# Altium schematic sheet Feeder_1U.SchDoc
size 594 x 420 mm; SheetNumber: 1; SheetTotal: 1; SPICEModelCacheOGAMDFTO: <root> / <DocumentId>OGAMDFTO</DocumentId> / <CacheFrame Number="0"> / <Model Name="865080645012_47uf" Kind="CKT"> / <Text>******* / .subckt 865080645012_47uF 1 2 / Rser 1 3 0.49 / Lser 2 4 0.000000002503 / C1 3 4 0.000047 / Rpar 3 4 2127659.57446809 / .ends 865080645012_47uF</Text> / </Model> / </CacheFrame> / </root>
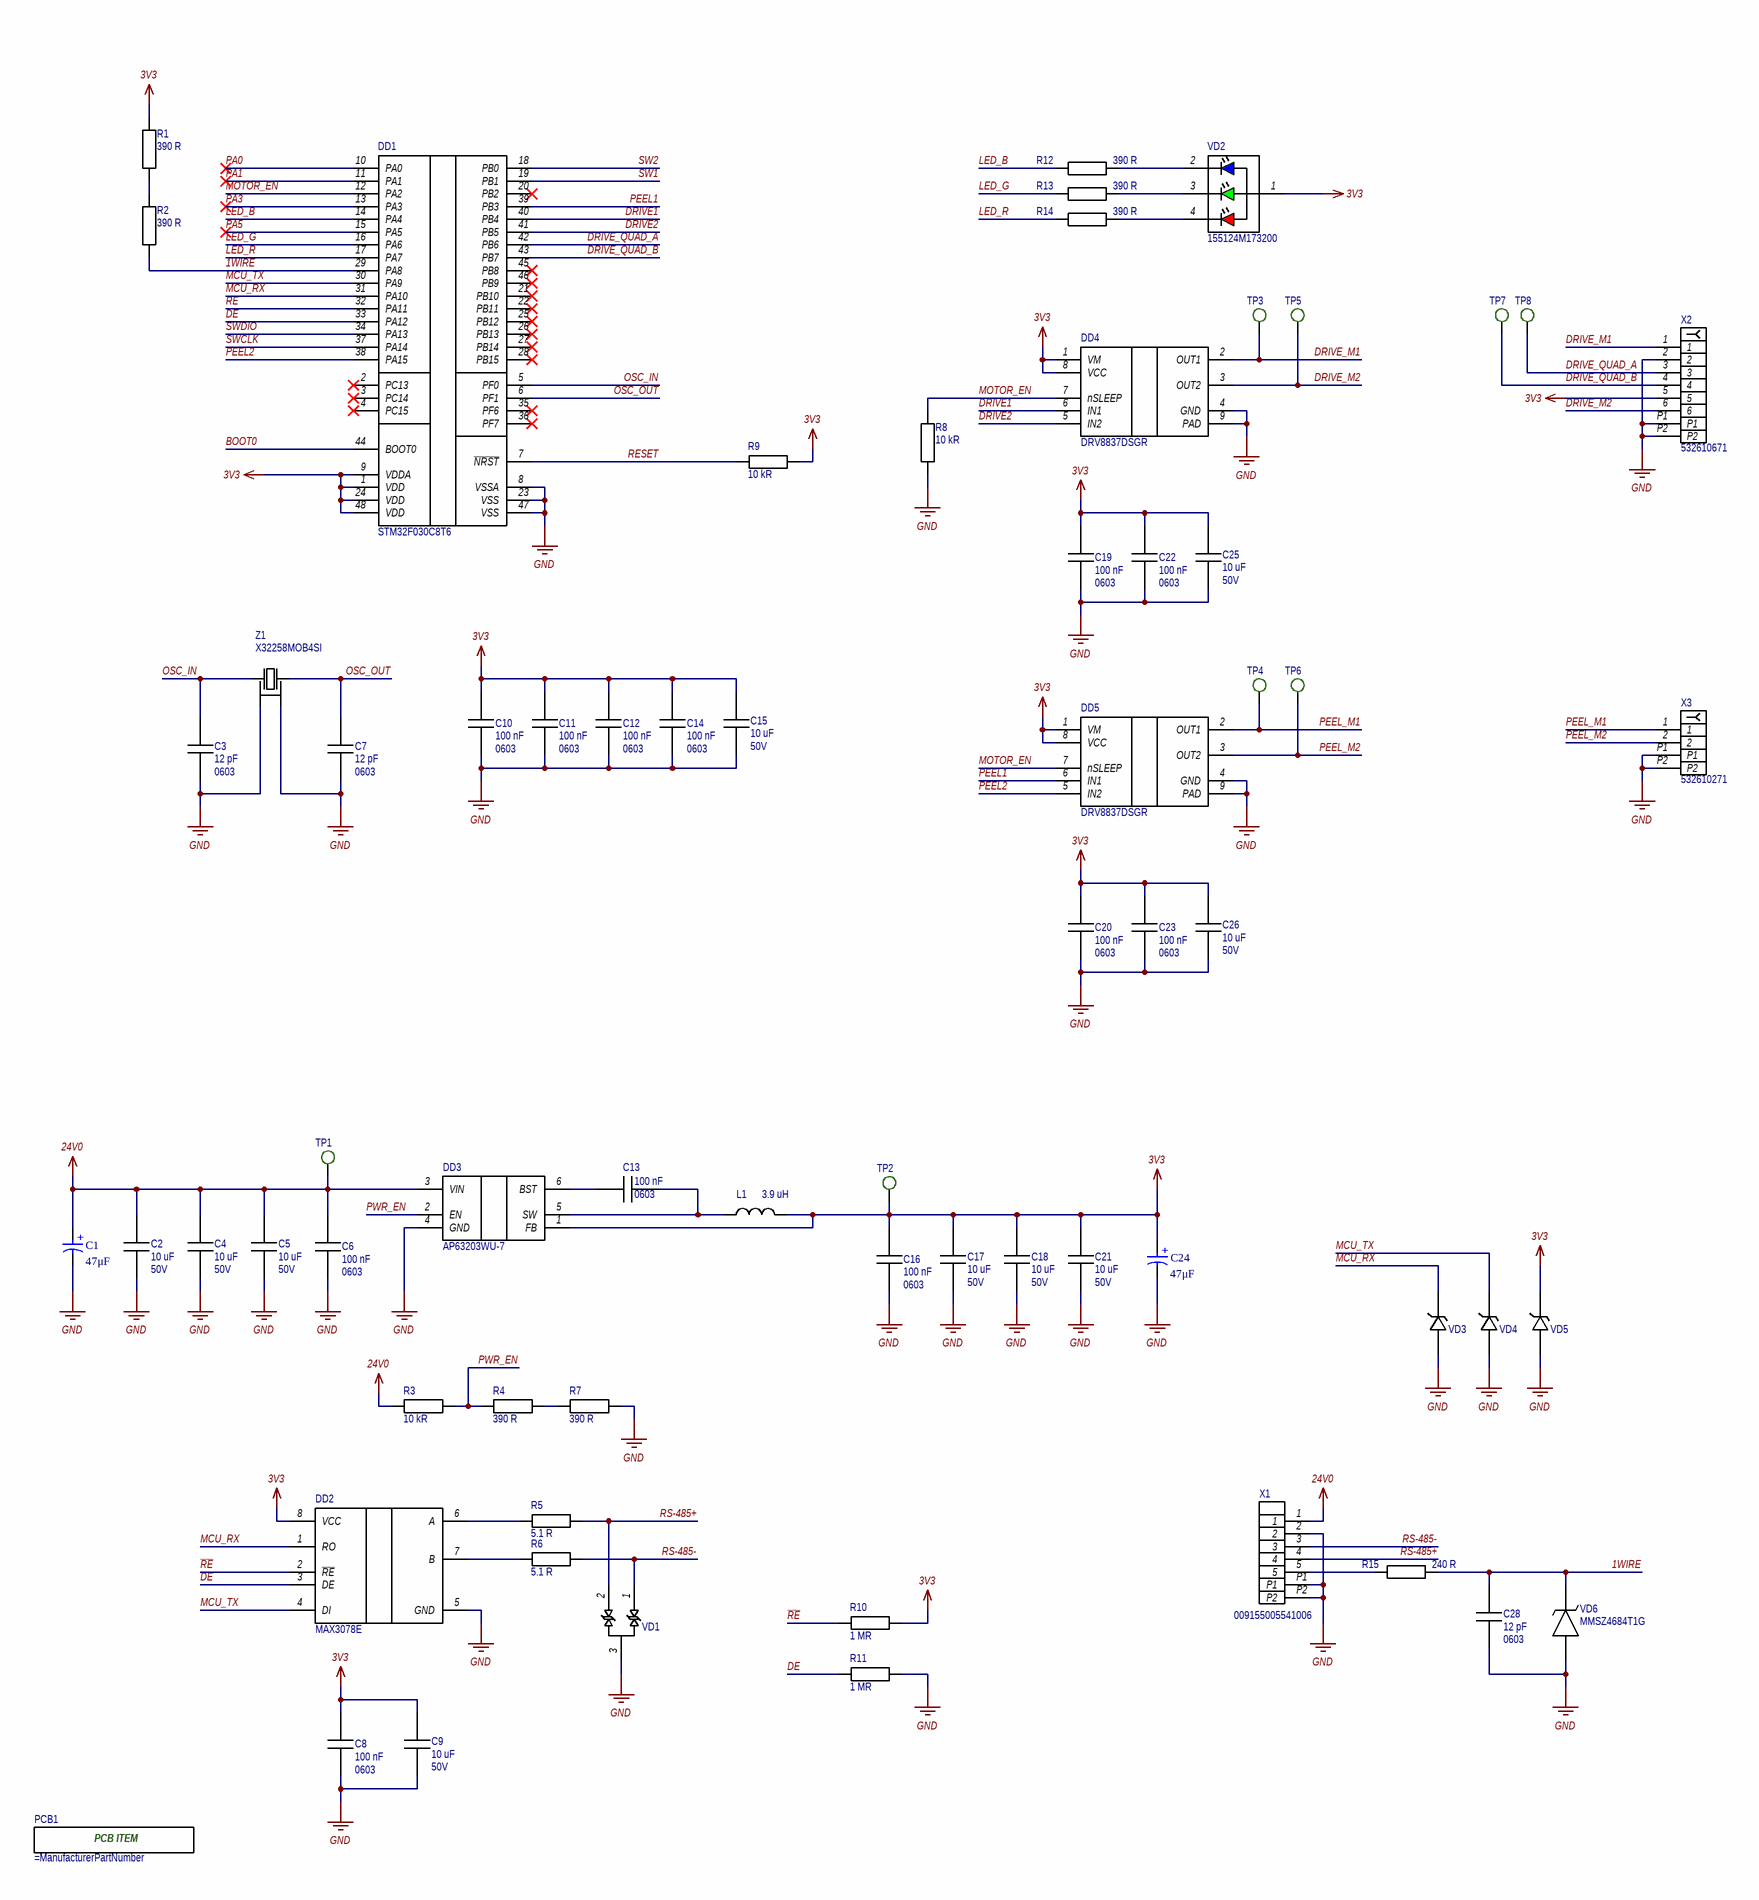
[diagram p0: Feeder_1U.SchDoc, left]
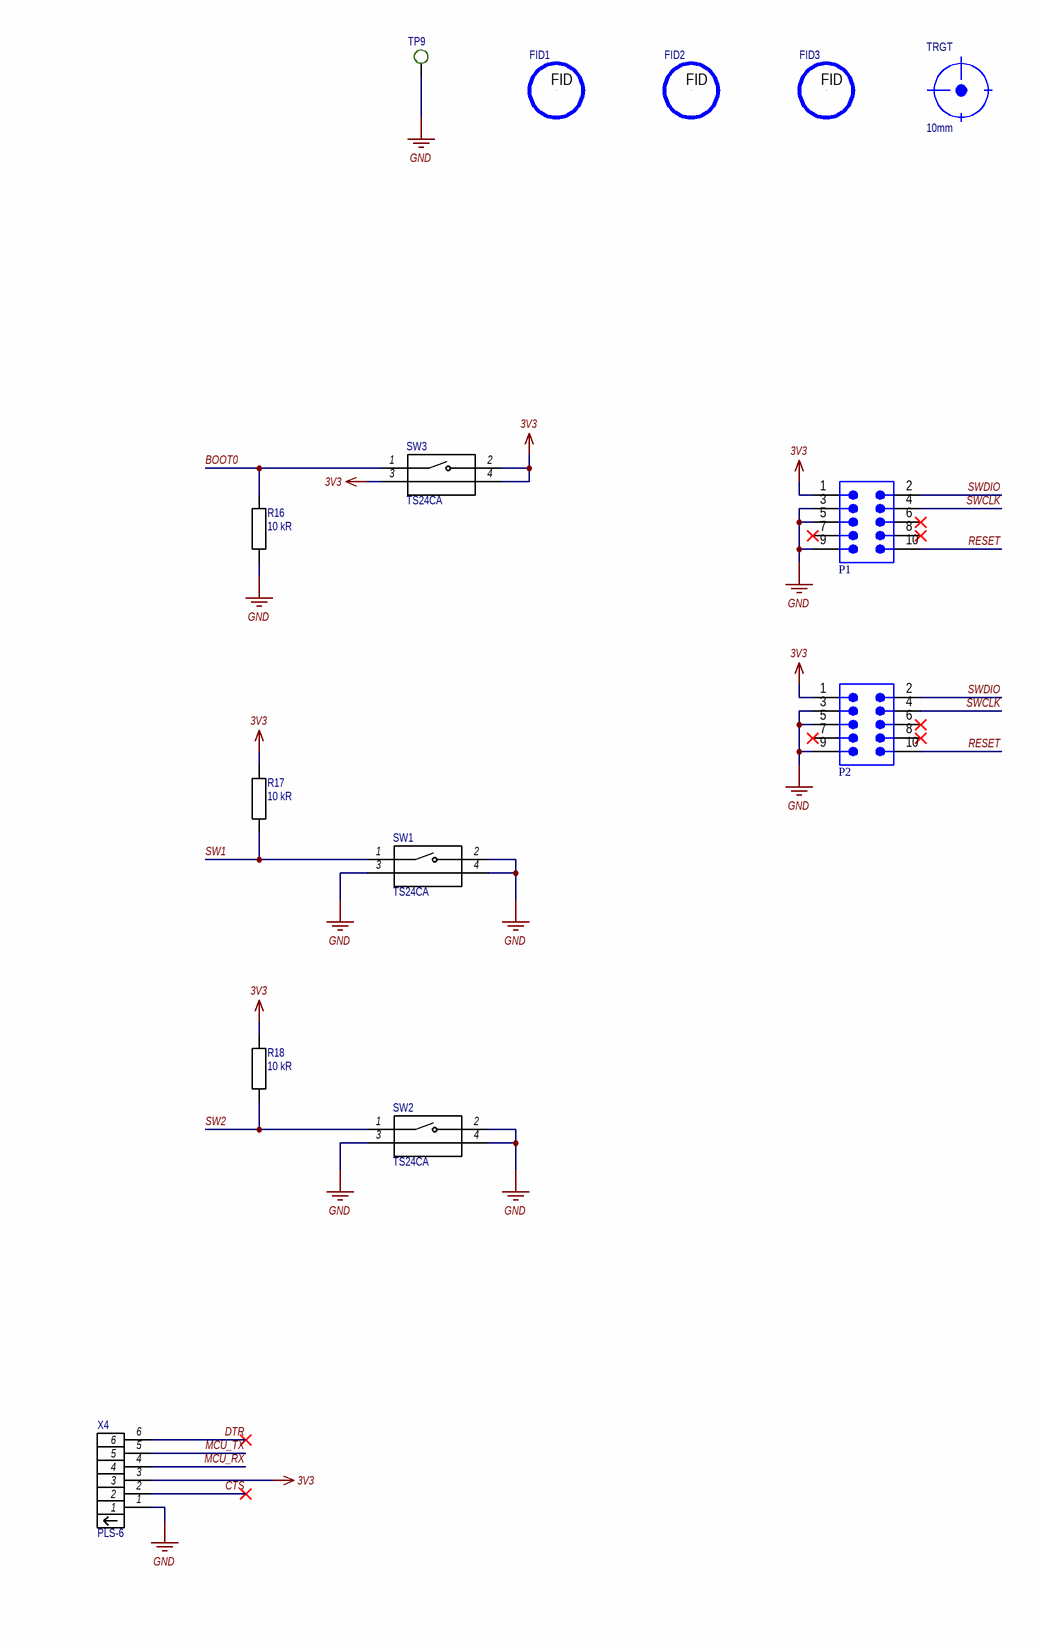
[diagram p1: Feeder_1U.SchDoc, right]

## Parts
C1  47μF  [WCAP-ASLI_D6.3H7.7]
C2  value 10 uF  Power/Voltage: 50V  [C_1206]  (hidden comment: CL31B106KBHNNNE)
C3  value 12 pF  Корпус: 0603  [C_0603]  (hidden comment: CC0603JRNPO9BN120)
C4  value 10 uF  Power/Voltage: 50V  [C_1206]  (hidden comment: CL31B106KBHNNNE)
C5  value 10 uF  Power/Voltage: 50V  [C_1206]  (hidden comment: CL31B106KBHNNNE)
C6  value 100 nF  Корпус: 0603  [C_0603]  (hidden comment: CC0603KRX7R9BB104)
C7  value 12 pF  Корпус: 0603  [C_0603]  (hidden comment: CC0603JRNPO9BN120)
C8  value 100 nF  Корпус: 0603  [C_0603]  (hidden comment: CC0603KRX7R9BB104)
C9  value 10 uF  Power/Voltage: 50V  [C_1206]  (hidden comment: CL31B106KBHNNNE)
C10  value 100 nF  Корпус: 0603  [C_0603]  (hidden comment: CC0603KRX7R9BB104)
C11  value 100 nF  Корпус: 0603  [C_0603]  (hidden comment: CC0603KRX7R9BB104)
C12  value 100 nF  Корпус: 0603  [C_0603]  (hidden comment: CC0603KRX7R9BB104)
C13  value 100 nF  Корпус: 0603  [C_0603]  (hidden comment: CC0603KRX7R9BB104)
C14  value 100 nF  Корпус: 0603  [C_0603]  (hidden comment: CC0603KRX7R9BB104)
C15  value 10 uF  Power/Voltage: 50V  [C_1206]  (hidden comment: CL31B106KBHNNNE)
C16  value 100 nF  Корпус: 0603  [C_0603]  (hidden comment: CC0603KRX7R9BB104)
C17  value 10 uF  Power/Voltage: 50V  [C_1206]  (hidden comment: CL31B106KBHNNNE)
C18  value 10 uF  Power/Voltage: 50V  [C_1206]  (hidden comment: CL31B106KBHNNNE)
C19  value 100 nF  Корпус: 0603  [C_0603]  (hidden comment: CC0603KRX7R9BB104)
C20  value 100 nF  Корпус: 0603  [C_0603]  (hidden comment: CC0603KRX7R9BB104)
C21  value 10 uF  Power/Voltage: 50V  [C_1206]  (hidden comment: CL31B106KBHNNNE)
C22  value 100 nF  Корпус: 0603  [C_0603]  (hidden comment: CC0603KRX7R9BB104)
C23  value 100 nF  Корпус: 0603  [C_0603]  (hidden comment: CC0603KRX7R9BB104)
C24  47μF  [WCAP-ASLI_D6.3H7.7]
C25  value 10 uF  Power/Voltage: 50V  [C_1206]  (hidden comment: CL31B106KBHNNNE)
C26  value 10 uF  Power/Voltage: 50V  [C_1206]  (hidden comment: CL31B106KBHNNNE)
C28  value 12 pF  Корпус: 0603  [C_0603]  (hidden comment: CC0603JRNPO9BN120)
DD1  STM32F030C8T6  [QFP-48]
DD2  MAX3078E  [SOP8]
DD3  AP63203WU-7  [TSOT-23-6]
DD4  DRV8837DSGR  [WSON-8]
DD5  DRV8837DSGR  [WSON-8]
FID1  FID  [FIDUCIAL]  (value not drawn)  (no BOM)
FID2  FID  [FIDUCIAL]  (value not drawn)  (no BOM)
FID3  FID  [FIDUCIAL]  (value not drawn)  (no BOM)
L1  value 3.9 uH  [IND_SDR0805]  (hidden comment: SDR0805-3R9ML)
P1  62101021021  [62101021021]  (value not drawn)
P2  62101021021  [62101021021]  (value not drawn)
PCB1  (no value)  (mechanical)
R1  value 390 R  [R_0603]  (hidden comment: RC0603FR-07390RL)
R2  value 390 R  [R_0603]  (hidden comment: RC0603FR-07390RL)
R3  value 10 kR  [R_0603]  (hidden comment: RC0603FR-0710KL)
R4  value 390 R  [R_0603]  (hidden comment: RC0603FR-07390RL)
R5  value 5.1 R  [R_0603]  (hidden comment: RC0603FR-075R1L)
R6  value 5.1 R  [R_0603]  (hidden comment: RC0603FR-075R1L)
R7  value 390 R  [R_0603]  (hidden comment: RC0603FR-07390RL)
R8  value 10 kR  [R_0603]  (hidden comment: RC0603FR-0710KL)
R9  value 10 kR  [R_0603]  (hidden comment: RC0603FR-0710KL)
R10  value 1 MR  [R_0603]  (hidden comment: RC0603FR-071ML)
R11  value 1 MR  [R_0603]  (hidden comment: RC0603FR-071ML)
R12  value 390 R  [R_0603]  (hidden comment: RC0603FR-07390RL)
R13  value 390 R  [R_0603]  (hidden comment: RC0603FR-07390RL)
R14  value 390 R  [R_0603]  (hidden comment: RC0603FR-07390RL)
R15  value 240 R  [R_0603]  (hidden comment: RC0603FR-07240RL)
R16  value 10 kR  [R_0603]  (hidden comment: RC0603FR-0710KL)
R17  value 10 kR  [R_0603]  (hidden comment: RC0603FR-0710KL)
R18  value 10 kR  [R_0603]  (hidden comment: RC0603FR-0710KL)
SW1  TS24CA  [TS24CA]
SW2  TS24CA  [TS24CA]
SW3  TS24CA  [TS24CA]
TP1  *  [TEST POINT ROUND]  (value not drawn)  (no BOM)
TP2  *  [TEST POINT ROUND]  (value not drawn)  (no BOM)
TP3  *  [TEST POINT ROUND]  (value not drawn)  (no BOM)
TP4  *  [TEST POINT ROUND]  (value not drawn)  (no BOM)
TP5  *  [TEST POINT ROUND]  (value not drawn)  (no BOM)
TP6  *  [TEST POINT ROUND]  (value not drawn)  (no BOM)
TP7  *  [TEST POINT ROUND]  (value not drawn)  (no BOM)
TP8  *  [TEST POINT ROUND]  (value not drawn)  (no BOM)
TP9  *  [TEST POINT ROUND]  (value not drawn)  (no BOM)
TRGT  10mm  [PrinterTarget]  (no BOM)
VD1  SM712  [SOT23]  (value not drawn)
VD2  155124M173200  [LED_3210_RGB_SIDE]
VD3  PESD3V3S1UL,315  [DFN1006-2_(SOD882)]  (value not drawn)
VD4  PESD3V3S1UL,315  [DFN1006-2_(SOD882)]  (value not drawn)
VD5  PESD3V3S1UL,315  [DFN1006-2_(SOD882)]  (value not drawn)
VD6  MMSZ4684T1G  [SOD-123]
X1  009155005541006  [009155005541006]
X2  532610671  [532610671]
X3  532610271  [532610271]
X4  PLS-6  [PLS-6-3D]
Z1  X32258MOB4SI  [SMD3225]

## Nets
3V3: C8.2 C9.2 C10.2 C11.2 C12.2 C14.2 C15.2 C16.2 C17.2 C18.2 C19.2 C20.2 C21.2 C22.2 C23.2 C24.1(P) C25.2 C26.2 DD1.1(VDD) DD1.9(VDDA) DD1.24(VDD) DD1.48(VDD) DD2.8(VCC) DD3.1(FB) DD4.1(VM) DD4.8(VCC) DD5.1(VM) DD5.8(VCC) L1.2 P1.1 P2.1 R1.1 R9.1 R10.2 R17.2 R18.2 SW3.2(NO_1) SW3.3(NO_2) SW3.4(NO_3) TP2.1 VD2.1(RED_ANODE) VD5.1 X2.5 X4.3
24V0: C1.1(P) C2.2 C4.2 C5.2 C6.2 DD3.3(VIN) R3.1 TP1.1 X1.1
GND: C1.2(N) C2.1 C3.2 C4.1 C5.1 C6.1 C7.2 C8.1 C9.1 C10.1 C11.1 C12.1 C14.1 C15.1 C16.1 C17.1 C18.1 C19.1 C20.1 C21.1 C22.1 C23.1 C24.2(N) C25.1 C26.1 C28.2 DD1.8(VSSA) DD1.23(VSS) DD1.47(VSS) DD2.5(GND) DD3.4(GND) DD4.4(GND) DD4.9(PAD) DD5.4(GND) DD5.9(PAD) P1.3 P1.5 P1.9 P2.3 P2.5 P2.9 R7.1 R8.2 R11.2 R16.1 SW1.2(NO_1) SW1.3(NO_2) SW1.4(NO_3) SW2.2(NO_1) SW2.3(NO_2) SW2.4(NO_3) TP9.1 VD1.3 VD3.2 VD4.2 VD5.2 VD6.2(A) X1.2 X1.P1 X1.P2 X2.2 X2.P1 X2.P2 X3.P1 X3.P2 X4.1 Z1.2 Z1.4
1WIRE: C28.1 DD1.29(PA8) R2.2 R15.2 VD6.1(K)
BOOT0: DD1.44(BOOT0) R16.2 SW3.1(COM_1)
CTS: X4.2
DE: DD1.33(PA12) DD2.3(DE) R11.1
DRIVE1: DD1.40(PB4) DD4.6(IN1)
DRIVE2: DD1.41(PB5) DD4.5(IN2)
DRIVE_M1: DD4.2(OUT1) TP3.1 X2.1
DRIVE_M2: DD4.3(OUT2) TP5.1 X2.6
DRIVE_QUAD_A: DD1.42(PB6) TP8.1 X2.3
DRIVE_QUAD_B: DD1.43(PB7) TP7.1 X2.4
DTR: X4.6
LED_B: DD1.14(PA4) R12.1
LED_G: DD1.16(PA6) R13.1
LED_R: DD1.17(PA7) R14.1
MCU_RX: DD1.31(PA10) DD2.1(RO) VD3.1 X4.4
MCU_TX: DD1.30(PA9) DD2.4(DI) VD4.1 X4.5
MOTOR_EN: DD1.12(PA2) DD4.7(nSLEEP) DD5.7(nSLEEP) R8.1
OSC_IN: C3.1 DD1.5(PF0) Z1.1
OSC_OUT: C7.1 DD1.6(PF1) Z1.3
PA0: DD1.10(PA0)
PA1: DD1.11(PA1)
PA3: DD1.13(PA3)
PA5: DD1.15(PA5)
PEEL1: DD1.39(PB3) DD5.6(IN1)
PEEL2: DD1.38(PA15) DD5.5(IN2)
PEEL_M1: DD5.2(OUT1) TP4.1 X3.1
PEEL_M2: DD5.3(OUT2) TP6.1 X3.2
PWR_EN: DD3.2(EN) R3.2 R4.2
~{RE}: DD1.32(PA11) DD2.2(~{RE}) R10.1
RESET: DD1.7(~{NRST}) P1.10 P2.10 R9.2
RS-485+: R5.2 VD1.2 X1.4
RS-485-: R6.2 VD1.1 X1.3
SW1: DD1.19(PB1) R17.1 SW1.1(COM_1)
SW2: DD1.18(PB0) R18.1 SW2.1(COM_1)
SWCLK: DD1.37(PA14) P1.4 P2.4
SWDIO: DD1.34(PA13) P1.2 P2.2
NetC13_1: C13.1 DD3.5(SW) L1.1
NetC13_2: C13.2 DD3.6(BST)
NetDD2_6: DD2.6(A) R5.1
NetDD2_7: DD2.7(B) R6.1
NetR1_2: R1.2 R2.1
NetR4_1: R4.1 R7.2
NetR12_2: R12.2 VD2.2(BLUE_CATHODE)
NetR13_2: R13.2 VD2.3(GREEN_CATHODE)
NetR14_2: R14.2 VD2.4(RED_CATHODE)
NetR15_1: R15.1 X1.5

Not connected (* = marked no-connect by the designer): DD1 2(PC13)* 3(PC14)* 4(PC15)* 20(PB2)* 21(PB10)* 22(PB11)* 25(PB12)* 26(PB13)* 27(PB14)* 28(PB15)* 35(PF6)* 36(PF7)* 45(PB8)* 46(PB9)*; FID1 FID(2); FID2 FID(2); FID3 FID(2); P1 6* 7* 8*; P2 6* 7* 8*

## Notes on the sheet
- Перв. примен.
- Справ. №
- Подп. и дата
- Инв. № дубл.
- Взам. инв. №
- Разраб.
- Изм.
- Лист
- № докум.
- Подп.
- Дата
- Лит.
- Масса
- Масштаб
- Пров.
- Т. контр.
- Листов
- Инв. № подл.
- Н. контр.
- Утв.
- Копировал
- Формат А2
- (in symbol 865080645012) +
- (in symbol !PCB) PCB ITEM

## Library data of the parts
C1 C24 = 865080645012: WCAP-ASLI Aluminum Electrolytic Capacitor, V-Chip, SMT, 6.3mm x 7.7mm, 47μF, 50V; Manufacturer: Wurth Elektronik; Dissipation Factor: 12%; Endurance: 2000h; Impedance: 700mΩ; Leakage Current: 23.5μA; Ripple Current: 230mA; Manufacturer Part Number: 865080645012; Category: Aluminum Electrolytic Capacitors; Match Code: WCAP-ASLI; ComponentLink1Description: Website Link; ComponentLink1URL: https://www.we-online.com/redexpert/article/865080645012?ad; ComponentLink2Description: Datasheet Link; ComponentLink2URL: https://www.we-online.com/redexpert/spec/865080645012?ad; Mount: Surface Mount; Min Operating Temperature: -55°C; Max Operating Temperature: 105°C; Packaging: Tape and Reel; Height: 7.7mm; Diameter: 6.3mm; Capacitance: 47μF; Rated Voltage (DC): 50V
C2 C4 C5 C9 C15 C17 C18 C21 C25 C26 = CL31B106KBHNNNE: C1206 10uF X7R 50V; Manufacturer: Samsung; AnalogPartNumber: TCC1206X7R106K500HT; Корпус: 1206; Tolerance: ±10%; GroupSpecification: 4; Technological stock: 2%; Type: X7R; ManufacturerPartNumber: CL31B106KBHNNNE; lcsc.com: C89632; Storage Category: Пассивные; Storage Subcategory: Конденсаторы керамические; Height: 1.6; Height Tolerance: 0.2; Mount: SMT
C3 C7 C28 = CC0603JRNPO9BN120: C0603 12pF 50V; Manufacturer: YAGEO; AnalogPartNumber: GRM1885C1H120J, TCC0603COG120J500CT, 0603CG120J500NT; Tolerance: ±5%; Type: NP0; GroupSpecification: 4; ChipDip.ru: 9000174425; Technological stock: 5%; ManufacturerPartNumber: CC0603JRNPO9BN120; Power/Voltage: 50V; lcsc.com: C107034; Storage Category: Пассивные; Storage Subcategory: Конденсаторы керамические; Height: 0.8; Height Tolerance: 0.1; Mount: SMT
C6 C8 C10-C14 C16 C19 C20 C22 C23 = CC0603KRX7R9BB104: C0603 100nF X7R ±10% 50V; Manufacturer: YAGEO; GroupSpecification: 4; ChipDip.ru: 9000073755; Technological stock: 5%; Tolerance: 10%; Type: X7R; ManufacturerPartNumber: CC0603KRX7R9BB104; lcsc.com: C14663; Power/Voltage: 50V; Storage Category: Пассивные; Storage Subcategory: Конденсаторы керамические; Height: 0.8; Height Tolerance: 0.1; Mount: SMT
DD1 = STM32F030C8T6: MCU STM32 ARM Cortex-M0 32Bit 48MHz; Manufacturer: STM; GroupSpecification: 4; ChipDip.ru: 9000222650; Technological stock: 1%; Корпус: QFP-48; Type: *; ManufacturerPartNumber: STM32F030C8T6; lcsc.com: C23922; Storage Category: Интегральные микросхемы; Storage Subcategory: Микросхемы цифровые; Mount: SMT
DD2 = MAX3078E: RS-485 Line Driver and Receiver; ManufacturerPartNumber: MAX3078EESA+T; Manufacturer: Maxim; AnalogPartNumber: MAX3078EM/TR; Корпус: SOP-8; GroupSpecification: 4; ChipDip.ru: 8004571231; Technological stock: 1%; Type: *; lcsc.com: C336020; Storage Category: Интегральные микросхемы; Storage Subcategory: Микросхемы цифровые; Mount: SMT
DD3 = AP63203WU-7: DC-DC Stepdown Fixed 2A 3.3V; Manufacturer: Diodes; GroupSpecification: 4; ChipDip.ru: 8025974122; Technological stock: 1%; Корпус: TSOT-23-6; Type: *; ManufacturerPartNumber: AP63203WU-7; lcsc.com: C780769; Storage Category: Интегральные микросхемы; Storage Subcategory: Преобразователи питания; Mount: SMT
DD4 DD5 = DRV8837DSGR: Motor Driver 1.8A; Manufacturer: TI; GroupSpecification: 4; ChipDip.ru: 9001130289; Technological stock: 5%; Storage Category: Интегральные микросхемы; Storage Subcategory: Преобразователи питания; ManufacturerPartNumber: DRV8837DSGR; Корпус: WSON-8; lcsc.com: C39159; Mount: SMT
FID1-FID3 = FIDUCIAL
L1 = SDR0805-3R9ML: L 3.9uH  4.4А; Manufacturer: BOURNS; Корпус: 7.8x7.8mm; Tolerance: ±20%; Type: 20 mOm; GroupSpecification: 4; ChipDip.ru: 8027118710; Technological stock: 2%; ManufacturerPartNumber: SDR0805-3R9ML; lcsc.com: C2047096; Storage Category: Пассивные; Storage Subcategory: Индуктивности и трансформаторы; Current: 4.4А; Height: 5.3; Height Tolerance: 0.3; Mount: SMT
P1 P2 = 62101021021: WR-PHD Pin Header, SMT, Vertical, pitch 1.27mm, 2 Row, 10P; Manufacturer: Wurth Elektronik; Contact Resistance: 20mOhm; Rated Current: 1A; Working Voltage: 100V; Withstanding Voltage: 300V; Manufacturer Part Number: 62101021021; Category: Board-to-Board Connectors; Match Code: WR-PHD; ComponentLink1Description: Website Link; ComponentLink1URL: https://www.we-online.com/redexpert/article/62101021021?ad; ComponentLink2Description: Datasheet Link; ComponentLink2URL: https://www.we-online.com/redexpert/spec/62101021021?ad; Mount: Surface Mount; Operating Temperature Max: 105°C; Operating Temperature Min: -40°C; Packaging: Tube; Gender: Pin Header; Number of Pins: 10; Number of Rows: 2; Orientation: Vertical; Pitch: 1.27mm
PCB1 = !PCB: Manufacturer: NOVA; GroupSpecification: 1; ManufacturerPartNumber: =DecimalNumberPCB; Storage Category: Платы и трафареты; Storage Subcategory: Плата печатная
R1 R2 R4 R7 R12-R14 = RC0603FR-07390RL: R0603 390±1% 50V; Manufacturer: YAGEO; AnalogPartNumber: 0603WAF3900T5E; Корпус: 0603; Tolerance: ±1%; GroupSpecification: 4; Power/Voltage: 100mW; ChipDip.ru: 9000079666; Technological stock: 5%; Type: *; ManufacturerPartNumber: RC0603FR-07390RL; lcsc.com: C23151; Storage Category: Пассивные; Storage Subcategory: Резисторы; Height: 0.45; Height Tolerance: 0.1; Mount: SMT
R3 R8 R9 R16-R18 = RC0603FR-0710KL: R0603 10k±1% 50V; Manufacturer: YAGEO; AnalogPartNumber: 0603WAF1002T5E; Корпус: 0603; Tolerance: ±1%; GroupSpecification: 4; Power/Voltage: 100mW; ChipDip.ru: 9000079736; Technological stock: 5%; Type: *; ManufacturerPartNumber: RC0603FR-0710KL; lcsc.com: C98220; Storage Category: Пассивные; Storage Subcategory: Резисторы; Height: 0.45; Height Tolerance: 0.1; Mount: SMT
R5 R6 = RC0603FR-075R1L: R0603 5R1±1% 50V; Manufacturer: YAGEO; AnalogPartNumber: 0603WAF1001T5E; Корпус: 0603; Tolerance: ±1%; GroupSpecification: 4; Power/Voltage: 100mW; ChipDip.ru: 8002004042; Technological stock: 5%; Type: *; ManufacturerPartNumber: RC0603FR-075R1L; lcsc.com: C114626; Storage Category: Пассивные; Storage Subcategory: Резисторы; Height: 0.45; Height Tolerance: 0.1; Mount: SMT
R10 R11 = RC0603FR-071ML: R0603 1M±1% 50V; Manufacturer: YAGEO; AnalogPartNumber: 0603WAF1001T5E; Корпус: 0603; Tolerance: ±1%; GroupSpecification: 4; Power/Voltage: 100mW; ChipDip.ru: 9000348749; Technological stock: 5%; Type: *; ManufacturerPartNumber: RC0603FR-071ML; lcsc.com: C105578; Storage Category: Пассивные; Storage Subcategory: Резисторы; Height: 0.45; Height Tolerance: 0.1; Mount: SMT
R15 = RC0603FR-07240RL: R0603 240±1% 50V; Manufacturer: YAGEO; AnalogPartNumber: 0603WAF2400T5E; Корпус: 0603; Tolerance: ±1%; GroupSpecification: 4; Power/Voltage: 100mW; ChipDip.ru: 9000079625; Technological stock: 5%; Type: *; ManufacturerPartNumber: RC0603FR-07240RL; lcsc.com: C23350; Storage Category: Пассивные; Storage Subcategory: Резисторы; Height: 0.45; Height Tolerance: 0.1; Mount: SMT
SW1-SW3 = TS24CA: Switch Tacticle (button) 4.7x1.9mm angle; Manufacturer: Shou HAN; ChipDip.ru: 8020502681; GroupSpecification: 4; Корпус: SMD,4.7x1.9mm; Technological stock: 2%; Link: https://www.lcsc.com/product-detail/C393942.html; Storage Category: Механика; Storage Subcategory: Кнопки и переключатели; ManufacturerPartNumber: TS24CA; lcsc.com: C393942; Mount: SMT
TP1-TP9 = TEST POINT: GroupSpecification: 4; Type: TestPoint; Storage Category: NULL; Storage Subcategory: NULL; Mount: PCB; Marking: *
TRGT = PrinterTarget_10mm: SMD Printer calibration PCB thikness target
VD1 = SM712: ESD Suppressor Diode TVS RS485; Manufacturer: TECH PUBLIC; Корпус: SOT-23-3; GroupSpecification: 4; Value: 15 V; ChipDip.ru: 9000855347; Technological stock: 5%; Type: *; ManufacturerPartNumber: SM712; Power/Voltage: 15 V; lcsc.com: C521963; Storage Category: Дискретные; Storage Subcategory: Диоды; Mount: SMT
VD2 = 155124M173200: LED RGB 3210 ANGLE; Manufacturer: Wurth Elec; AnalogPartNumber: MHS110FRGBCT; GroupSpecification: 4; ChipDip.ru: 8003216021; Technological stock: 2%; Корпус: SMD-3210; Type: RGB; ManufacturerPartNumber: 155124M173200; lcsc.com: C496820; Storage Category: Оптика; Storage Subcategory: Светодиод; Mount: SMT
VD3-VD5 = PESD3V3S1UL,315: ESD Suppressor Diode TVS 3V3; Manufacturer: Nexperia; Корпус: SOD-882; GroupSpecification: 4; Power/Voltage: 150 W; ChipDip.ru: 9002042105; Technological stock: 5%; Value: 3.3 V; Type: *; ManufacturerPartNumber: PESD3V3S1UL,315; lcsc.com: C70371; Storage Category: Дискретные; Storage Subcategory: Диоды; Mount: SMT
VD6 = MMSZ4684T1G: Zener Diode 3.3V SOD-123; Manufacturer: onsemi; ChipDip.ru: 8002034742; GroupSpecification: 4; Technological stock: 2%; lcsc.com: C24672; Корпус: SOD-123; ManufacturerPartNumber: MMSZ4684T1G; Storage Category: Дискретные; Storage Subcategory: Диоды; Mount: SMT
X1 = 009155005541006: Connector, пружинный контакт для аккумулятора, шаг 2.5мм; Manufacturer: Kyocera AVX; Technological stock: 1%; ChipDip.ru: 8004951164; ManufacturerPartNumber: 009155005541006; Storage Category: Разъемы; Storage Subcategory: Разъемы низкоскоростные; System: Connector; Mount: SMD; lcsc.com: C3035810
X2 = 532610671: Connector Molex PicoBlade SMD 6pin; GroupSpecification: 4; ChipDip.ru: 9000714914; Technological stock: 1%; lcsc.com: C2845383; Manufacturer: MOLEX; ManufacturerPartNumber: 532610671; System: Connector; Storage Category: Разъемы; Storage Subcategory: Разъемы силовые; Mount: SMD
X3 = 532610271: Connector Molex PicoBlade SMD 2pin; GroupSpecification: 4; ChipDip.ru: 9000658519; Technological stock: 1%; lcsc.com: C177225; Manufacturer: MOLEX; ManufacturerPartNumber: 532610271; System: Connector; Storage Category: Разъемы; Storage Subcategory: Разъемы силовые; Mount: SMD
X4 = PLS-6: Header, 6-Pin; System: Connector; Technological stock: 1%; ManufacturerPartNumber: PLS-6; Storage Category: Разъемы; Storage Subcategory: Разъемы низкоскоростные; Mount: THT
Z1 = X32258MOB4SI: Crystal 8MHz 12pF; Manufacturer: YXC Crystal Oscillators; Tolerance: ±10ppm; GroupSpecification: 4; ChipDip.ru: 8013011769; smd.ru: SX3225-12.000-12; Technological stock: 1%; Корпус: SMD3225; ManufacturerPartNumber: X32258MOB4SI; lcsc.com: C2682775; Power/Voltage: *; Value: 8 MHz; Storage Category: Пассивные; Storage Subcategory: Резонаторы и генераторы; Height: 0.7; Height Tolerance: 0.1; Mount: SMT